# Altium schematic sheet Input_Driver_ADC.SchDoc
size A4; SheetNumber: 5; SheetTotal: 7
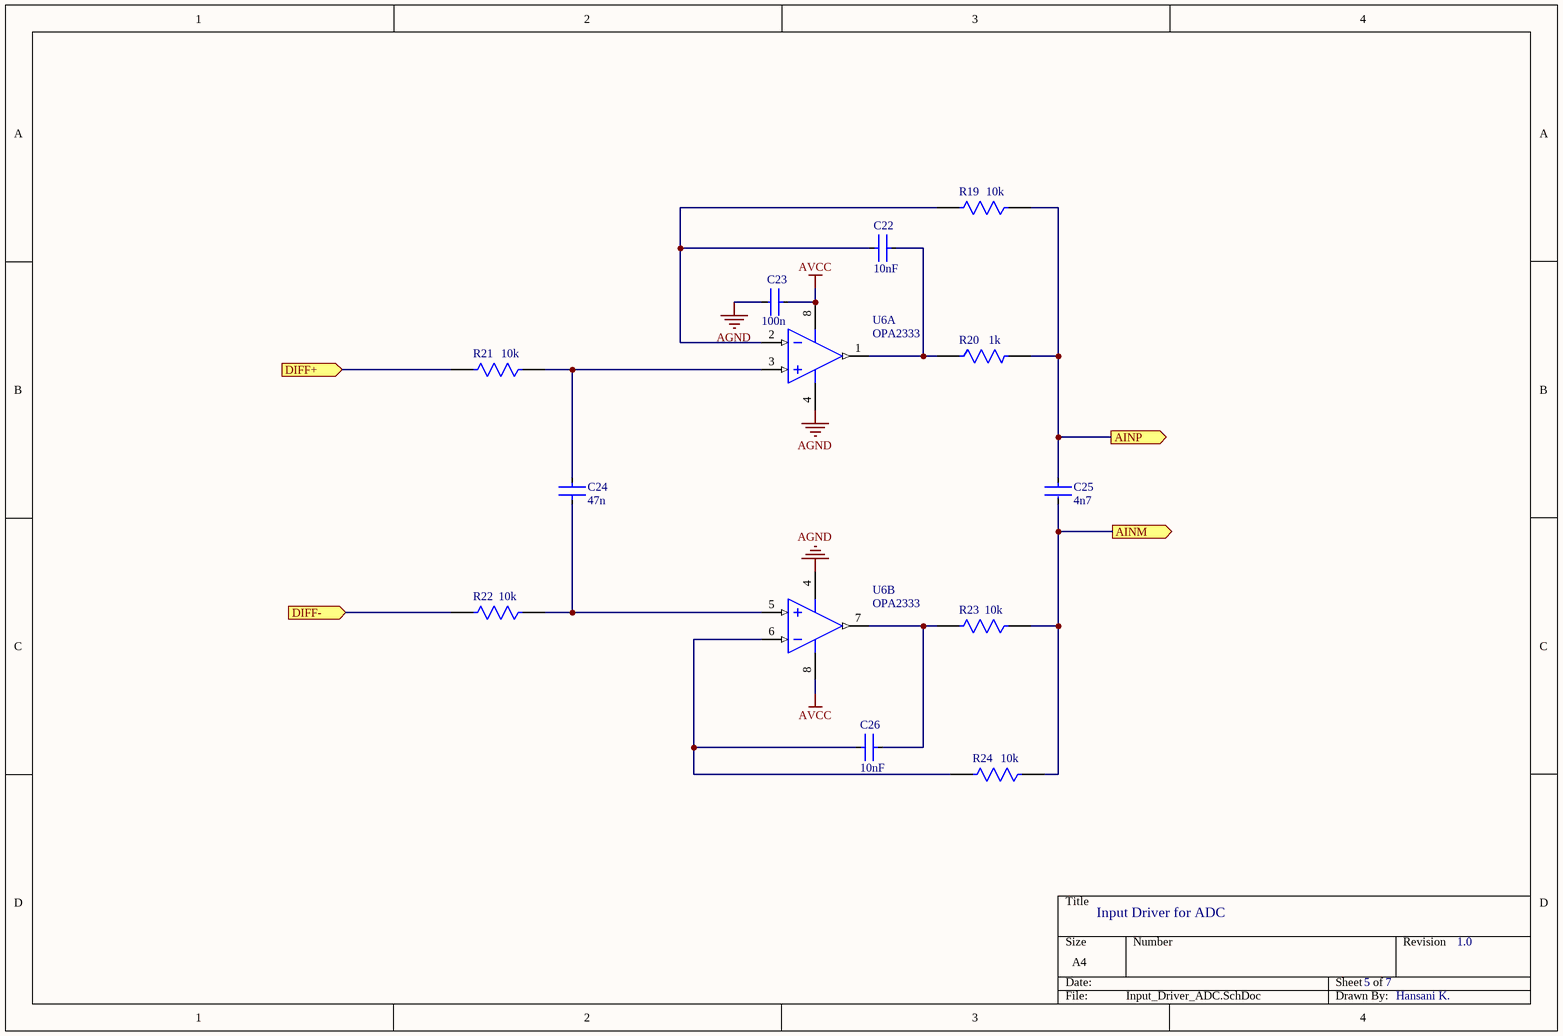
[diagram p0: Input_Driver_ADC.SchDoc]

## Parts
C22  10nF  [PCBComponent_1]
C23  100n  [FP-GRM155-0_05-MFG]
C24  47n  [PCBComponent_1]
C25  4n7  [FP-AC0805-0_85-MFG]
C26  10nF  [PCBComponent_1]
R19  10k  [FP-CRGCQ0805-IPC_C]
R20  1k  [FP-PATT0805-MFG]
R21  10k  [FP-CRGCQ0805-IPC_C]
R22  10k  [FP-CRGCQ0805-IPC_C]
R23  10k  [FP-CRGCQ0805-IPC_C]
R24  10k  [FP-CRGCQ0805-IPC_C]
U6  OPA2333  [DGK0008A_M]  (parts A,B of 2)

## Ports
AINM (out, see Wireless_ECG_Monitor[3B], ADC[3B]), AINP (out, see Wireless_ECG_Monitor[3B], ADC[3B]), DIFF+ (in, see Wireless_ECG_Monitor[2B], Instrumentation_Amp[4B]), DIFF- (in, see Wireless_ECG_Monitor[2B], Instrumentation_Amp[4C])

## Nets
AGND: C23.2 U6.4(V-)
AVCC: C23.1 U6.8(V+)
AINM: C25.2 R23.1 R24.1 ; port AINM
AINP: C25.1 R19.1 R20.2 ; port AINP
DIFF+: R21.2 ; port DIFF+
DIFF-: R22.2 ; port DIFF-
NetC22_1: C22.1 R19.2 U6.2(IN_A-)
NetC22_2: C22.2 R20.1 U6.1(OUT_A)
NetC24_1: C24.1 R21.1 U6.3(IN_A+)
NetC24_2: C24.2 R22.1 U6.5(IN_B+)
NetC26_1: C26.1 R24.2 U6.6(IN_B-)
NetC26_2: C26.2 R23.2 U6.7(OUT_B)

## Notes on the sheet
- Input Driver for ADC
- 5
- 7
- 1.0
- Hansani K.

## Library data of the parts
C22 C26 = CDR31BX103AKYRMJ: Ceramic Capacitor, Multilayer, Ceramic, 100V, 10% +Tol, 10% -Tol, BX, 15% TC, 0.001uF, Surface Mount, 0805; Manufacturer: Vishay; Supplier: Avnet; Supplier Part Number: CDR31BX103AKYRMJ; Manufacturer Part Number: CDR31BX103AKYRMJ; RoHS: Compliant; Category: Ceramic Capacitors; Value: 10nF; Case/Package: 0805; Depth: 1.25mm; Length: 2mm; Max Operating Temperature: 125°C; Min Operating Temperature: -55°C; Mounting Technology: Surface Mount; Tolerance: 10%; ComponentLink1URL: http://sigma.octopart.com:80/rohs_statement/Vishay-company-15.pdf?src-supplier=Compliance+Statements; ComponentLink1Description: http://sigma.octopart.com:80/rohs_statement/Vishay-company-15.pdf?src-supplier=Compliance+Statements
C23 = CMP-06035-040303-1: Chip Multilayer Ceramic Capacitors for General Purpose, 0402, 0.10uF, B, 10%, 20%, 50V
C24 = C0805C473F3GECAUTO7210: Multilayer Ceramic Capacitors MLCC - SMD/SMT 25V 0.047uF C0G 0805 1% AEC-Q200; Manufacturer: KEMET; Value: 47nF; Supplier: DigiKey; Supplier Part Number: 399-C0805C473F3GECAUTO7210CT-ND; Manufacturer Part Number: C0805C473F3GECAUTO7210; RoHS: Compliant; Category: Ceramic Capacitors; Stock: 6264; Pricing: 1=1.42, 10=0.933, 50=0.7474, 100=0.7248, 500=0.63154, 1000=0.60196, 2500=0.57544 (USD); Dielectric Material: Ceramic; Height: 1.25mm; Length: 2mm; Lifecycle Status: Production; Max Operating Temperature: 125°C; Min Operating Temperature: -55°C; Mounting Technology: Surface Mount; Number of Terminals: 2; REACH SVHC: Yes; Voltage Rating (DC): 25V; Width: 1.25mm; ComponentLink1URL: https://datasheet.octopart.com:443/C0805C473F3GECAUTO7210-KEMET-datasheet-176292478.pdf?src-supplier=IHS; ComponentLink1Description: https://datasheet.octopart.com:443/C0805C473F3GECAUTO7210-KEMET-datasheet-176292478.pdf?src-supplier=IHS; ComponentLink2URL: https://datasheet.octopart.com:443/C0805C473F3GECAUTO7210-KEMET-datasheet-189767466.pdf?src-supplier=ODG+(Origin+Data+Global); ComponentLink2Description: https://datasheet.octopart.com:443/C0805C473F3GECAUTO7210-KEMET-datasheet-189767466.pdf?src-supplier=ODG+(Origin+Data+Global)
C25 = CMP-03422-000574-1: CAP CER 4700PF 100V X7R 0805; Manufacturer: Yageo; Manufacturer Part Number: AC0805KRX7R0BB472; Tolerance: 0.1; Temperature Coefficient: 15%; Value: 4.7 nF; Automotive Grade: Grade 1; Material: Ceramic; Temperature Range Low: -55°C; Digikey Description: CAP CER 4700PF 100V X7R 0805; Lead Free: Yes; Capacitance: 4.7 nF; Ipc Land Pattern Name: CAPC200125X85; Voltage Rating: 100 V; Category: Cap; Footprint Url: http://www.yageo.com/exep/pages/download/literatures/UPY-C_GEN_24.pdf; Device Class L1: Passive Components; Temperature Characteristic: X7R; ComponentLink2URL: http://www.yageo.com/documents/recent/UPY-AC_NP0X7R_16V-to-630V_12.pdf; ComponentLink2Description: Datasheet; Automotive: Yes; Temperature Range High: +125°C; Device Class L3: Ceramic Capacitors; Device Class L2: Capacitors; Temperature: -55°C to +125°C; Octopart: https://octopart.com/ac0805krx7r0bb472-yageo-78873433; Package: AC0805-0.85; RoHS: TRUE; Height: 0.95mm
R19 R21-R24 = CMP-03211-002989-1: CRGCQ 0805 10K 5%; Manufacturer Part Number: CRGCQ0805J10K; Manufacturer: TE Connectivity; Voltage Rating: 150V; Temperature Coefficient: ±100ppm/°C; Resistance: 10KΩ; Value: 10KΩ; Power Rating: 0.125W; Tolerance: 0.05; Automotive Grade: Grade 914; Height: 0.65mm; Lead Free: Yes; Temperature Range High: +155°C; Composition: Thick Film; Temperature Range Low: -55°C; Ambient Temperature Range High: +70°C; Temperature: -55°C to +155°C; Package: CRGCQ0805; Device Class L2: Resistors; RoHS: TRUE; ComponentLink2URL: https://www.te.com/commerce/DocumentDelivery/DDEController?Action=showdoc&DocId=Data+Sheet%7F1773204-3%7F1%7Fpdf%7FEnglish%7FENG_DS_1773204-3_1.pdf%7F4-2176341-923; Series: CRGCQ; Device Class L1: Passive Components; Ipc Land Pattern Name: RESC200125X55; ComponentLink2Description: Datasheet; Category: Res; Digikey Description: CRGCQ 0805 10K 5%; Mouser Description: Res Thick Film 0805 10K Ohm 5% 0.125W(1/8W) ±100ppm/C Pad SMD Automotive T/R; Automotive: Yes; Octopart: https://octopart.com/crgcq0805j10k-te+connectivity-91018201; Device Class L3: Chip SMD Resistors
R20 = CMP-02407-000013-1: RES SMD 1K OHM 0.1% 1/5W 0805; Manufacturer Part Number: PATT0805E1001BGT1; Manufacturer: Vishay; Automotive Grade: Grade 0; Resistance: 1kΩ; Voltage Rating: 100V; Temperature Coefficient: 25ppm/°C; Value: 1kΩ; Power Rating: 200mW; ComponentLink2Description: Datasheet; Device Class L1: Passive Components; Footprint Url: https://www.vishay.com/docs/60119/landpatterns.pdf; Lead Free: Yes; Device Class L2: Resistors; Tolerance: 0.1%; Temperature: -55°C to +250°C; Height: 0.018inch; Series: PATT; Device Class L3: Chip SMD Resistors; Temperature Range High: +250°C; RoHS: TRUE; Octopart: https://octopart.com/patt0805e1001bgt1-vishay-34963130; Category: Res; Digikey Description: RES SMD 1K OHM 0.1% 1/5W 0805; Automotive: Yes; Package: PATT0805; ComponentLink2URL: https://www.vishay.com/docs/60124/patt.pdf; Temperature Range Low: -55°C; Composition: Thin Film; Ipc Land Pattern Name: RESC203127X38
U6 = CMP-0272-01196-3: 17 uA, MicroPower, Precision, Zero Drift CMOS Operational Amplifier, 1.8 to 5.5 V, -40 to 125 degC, 8-pin SOP (DGK8), Green (RoHS & no Sb/Br); Manufacturer: Texas Instruments; PartNumber: OPA2333AIDGKR; CMRR(Min)(dB): 106; IIB(Max)(pA): 200; Slew Rate(Typ)(V/us): 0.16; Sub Family: Low Offset Voltage Amplifier (<=500uV), Low Power Amp (<=500uA), Low Supply Voltage Amplifier (<=2.7V), Precision Amplifier, Zero Drift Precision Amplifier; Total Supply Voltage(Min)(+5V is 5, +/-5V is 10): 1.8; Total Supply Voltage(Max)(+5V is 5, +/-5V is 10): 5.5; Offset Drift(Typ)(uV/C): 0.02; Number of Channels: 2; Iq per channel(Max)(mA): 0.025; Vio (25C)(Max)(mV): 0.01; PackageVersion: 4073329/E, 05/2006; ComponentLink3URL: http://www.ti.com/litv/pdf/mpds028d; Eco-Plan: Green (RoHS & no Sb/Br); ComponentLink2URL: http://www.ti.com/general/docs/lit/getliterature.tsp?genericPartNumber=OPA2333&fileType=pdf; Mounting Technology: Surface Mount; PackageDescription: 8-Pin Thin Small Outline, Body 3 x 3 mm, Pitch 0.65 mm; DatasheetVersion: SBOS351C; ComponentLink1Description: Manufacturer URL; Code_JEDEC: MO-187; ComponentLink3Description: Package Specification; ComponentLink1URL: http://www.ti.com/; ComponentLink2Description: Datasheet; PackageReference: DGK0008A